# Altium project WAB_1x4.PrjPcb (part 2 of 2)

## Sheet WAB_1x4_top.SchDoc
size A2
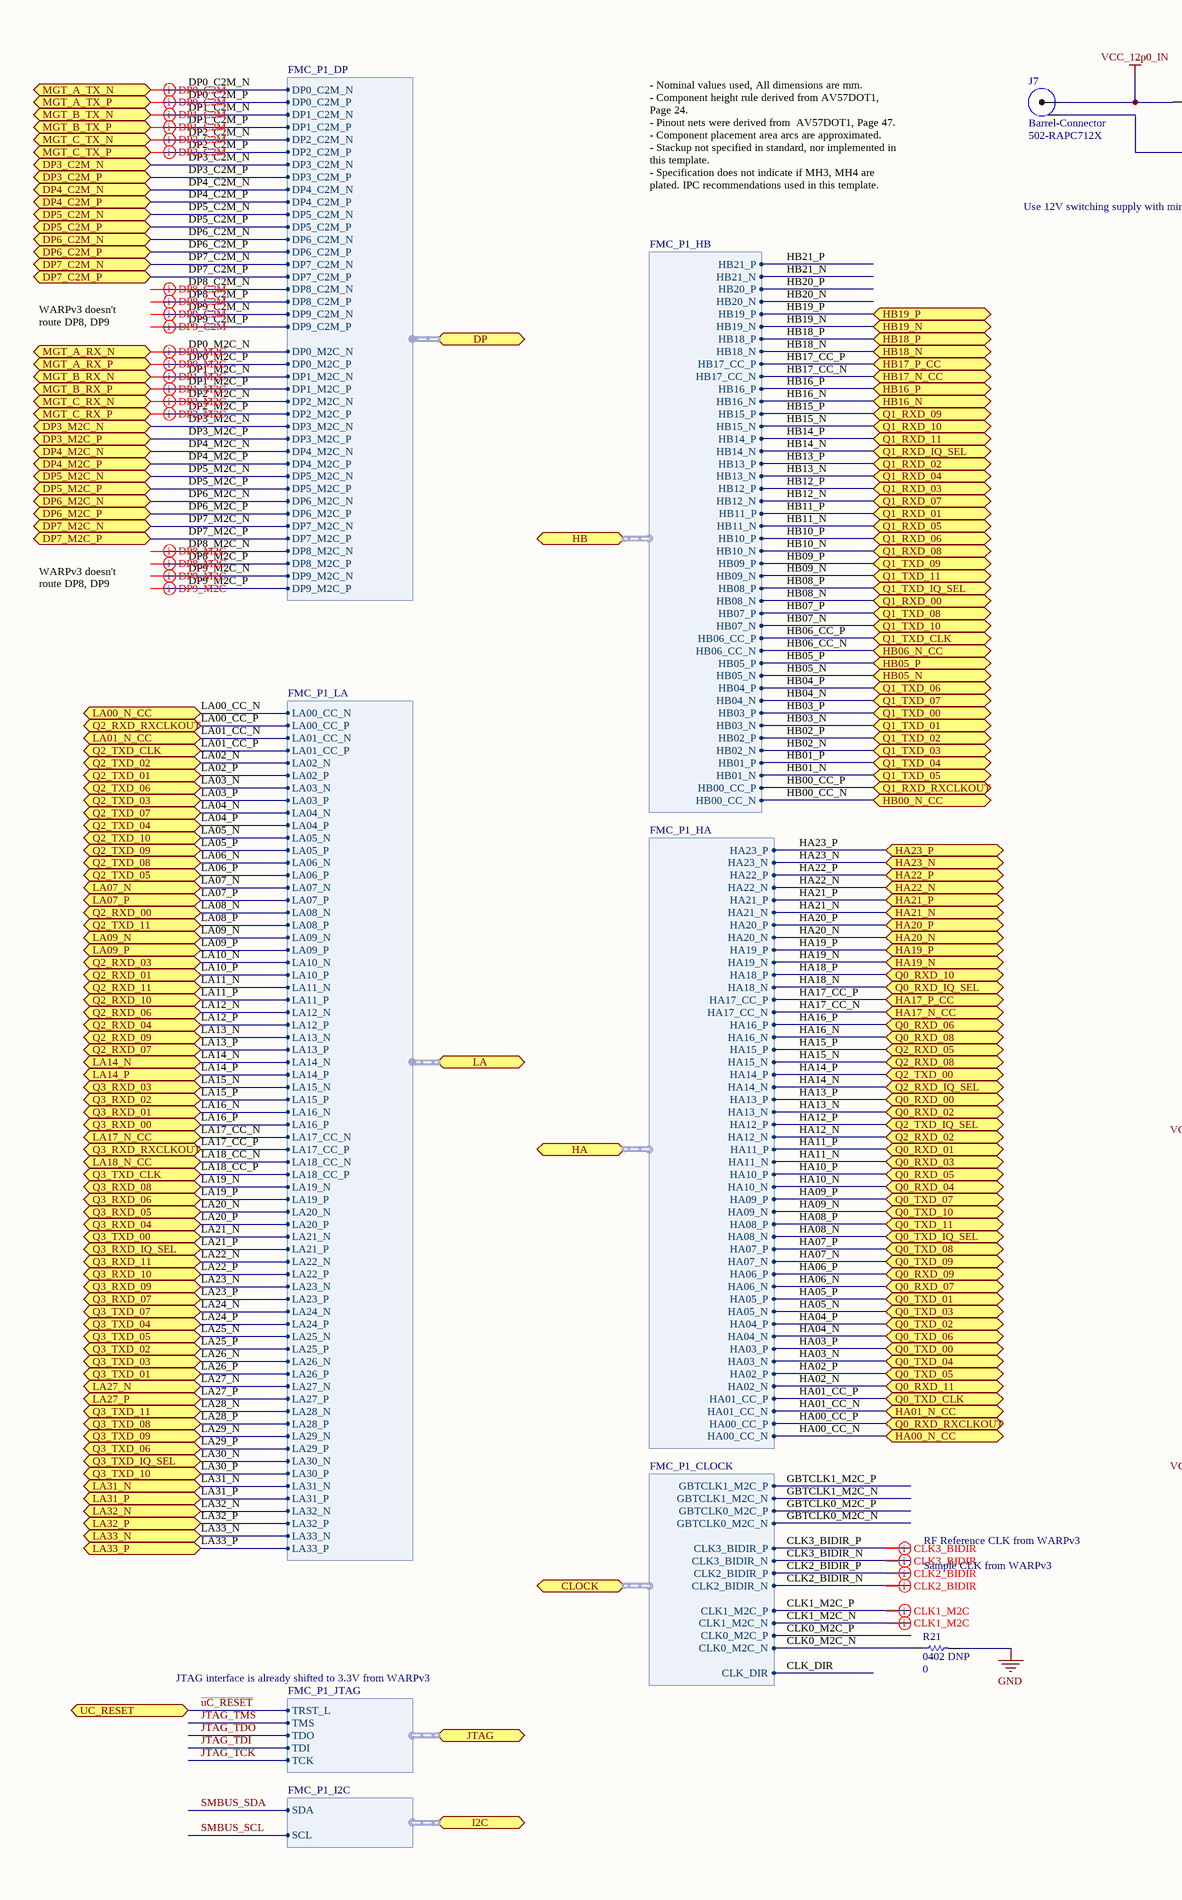
[diagram p4: WAB_1x4_top.SchDoc, left]
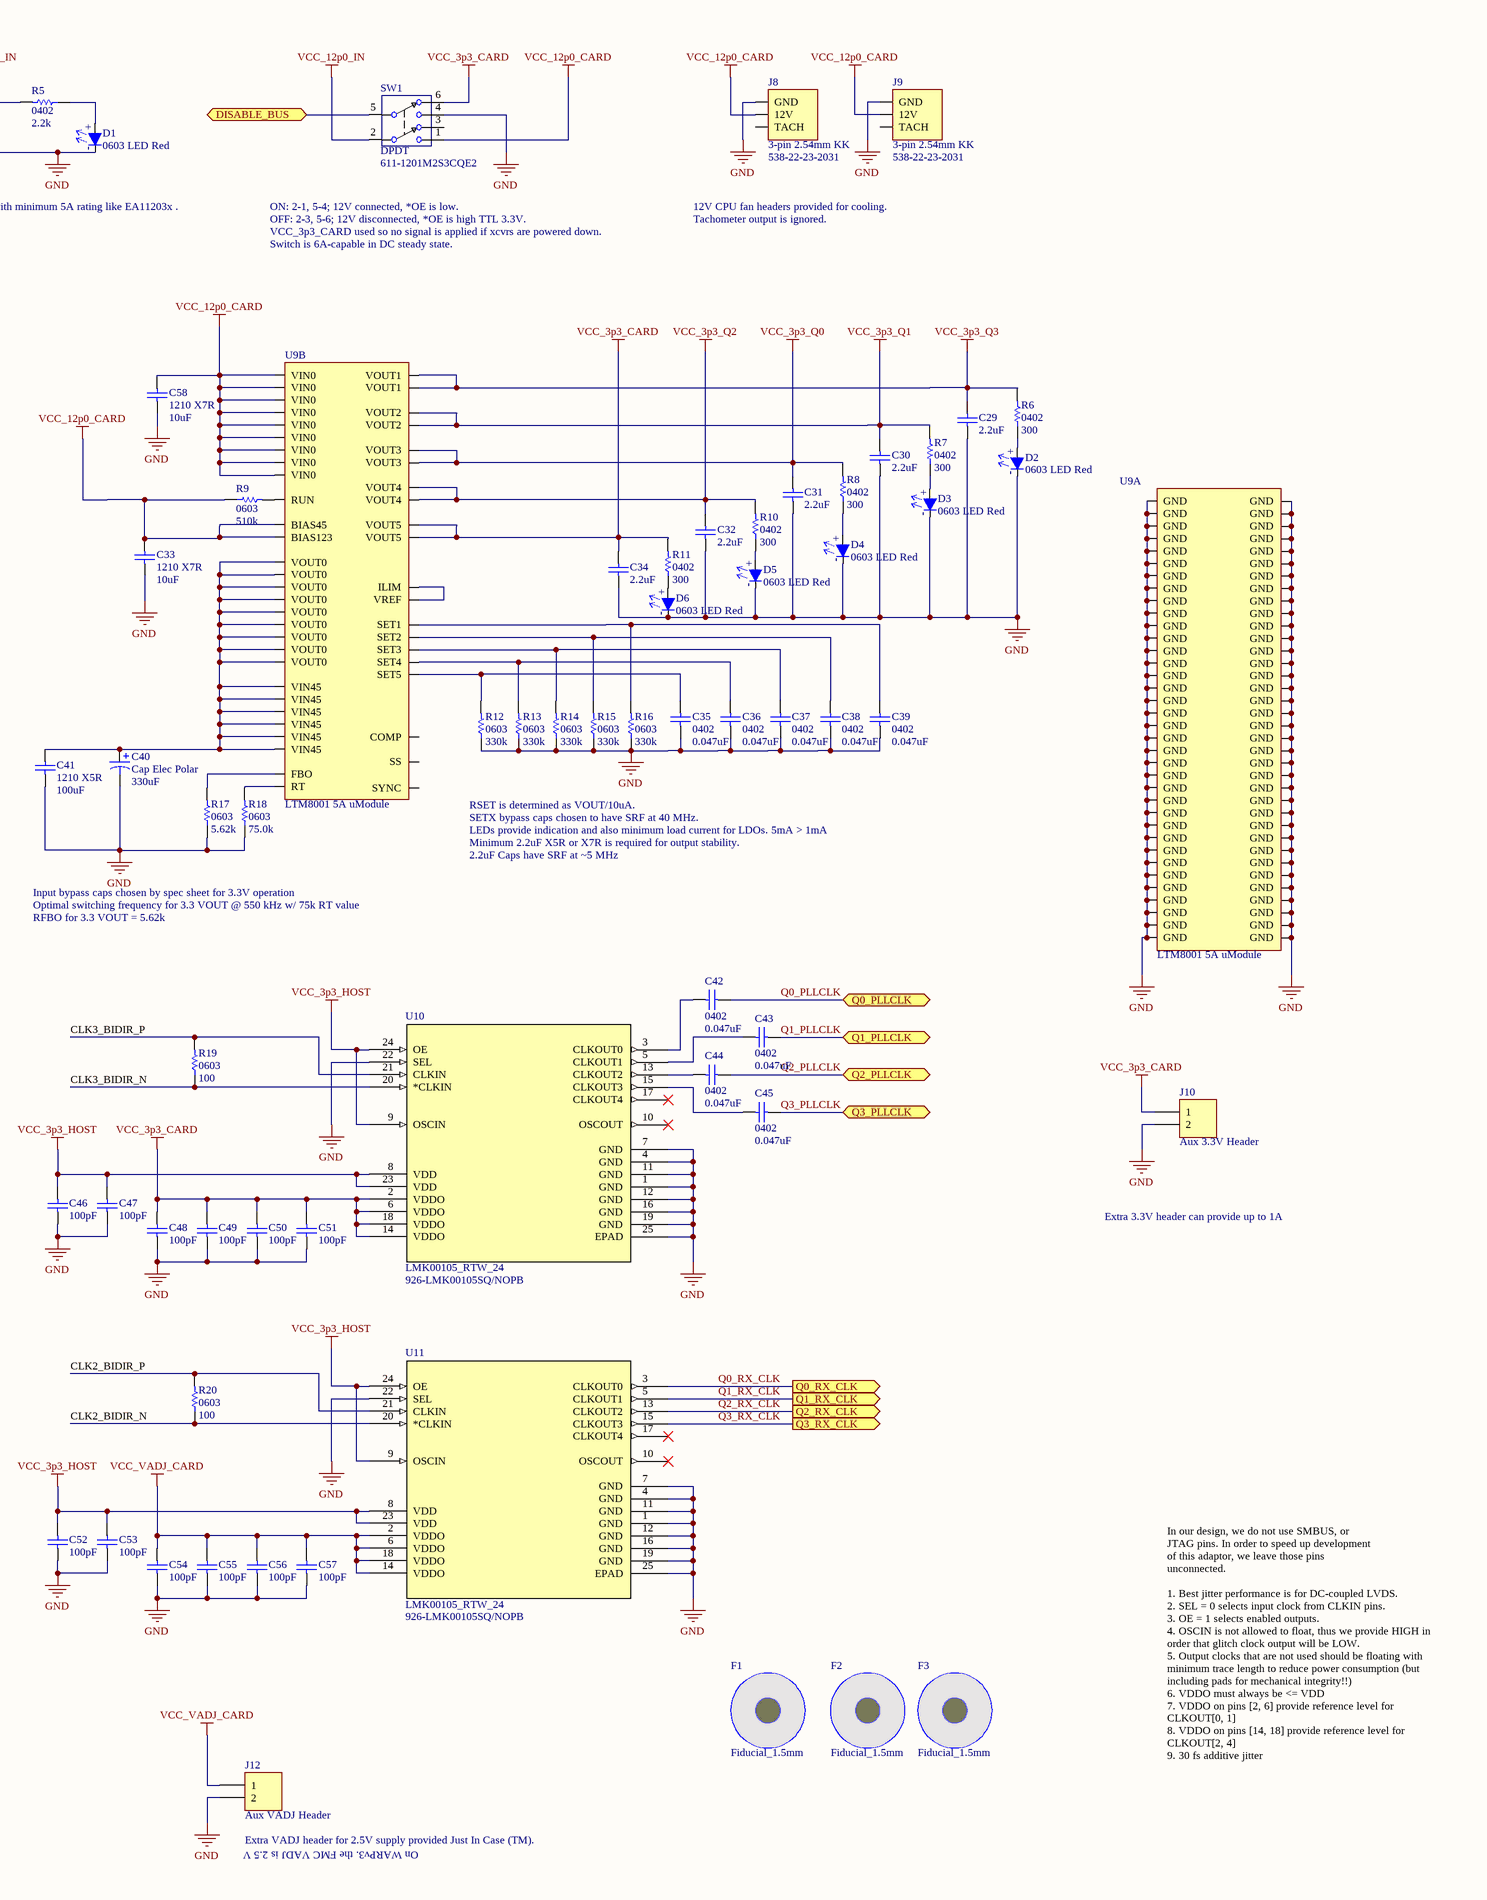
[diagram p5: WAB_1x4_top.SchDoc, right]

### Parts
C29  value 2.2uF  [0402_SMT_CAP]  (hidden comment: 0402)
C30  value 2.2uF  [0402_SMT_CAP]  (hidden comment: 0402)
C31  value 2.2uF  [0402_SMT_CAP]  (hidden comment: 0402)
C32  value 2.2uF  [0402_SMT_CAP]  (hidden comment: 0402)
C33  1210 X7R  value 10uF  [1210_Chip_Cap]
C34  value 2.2uF  [0402_SMT_CAP]  (hidden comment: 0402)
C35  0402  value 0.047uF  [0402_SMT_CAP]
C36  0402  value 0.047uF  [0402_SMT_CAP]
C37  0402  value 0.047uF  [0402_SMT_CAP]
C38  0402  value 0.047uF  [0402_SMT_CAP]
C39  0402  value 0.047uF  [0402_SMT_CAP]
C40  Cap Elec Polar  value 330uF  [OSCON-SVPC-C6-V3_V2]
C41  1210 X5R  value 100uF  [1210_Chip_Cap]
C42  0402  value 0.047uF  [0402_SMT_CAP]
C43  0402  value 0.047uF  [0402_SMT_CAP]
C44  0402  value 0.047uF  [0402_SMT_CAP]
C45  0402  value 0.047uF  [0402_SMT_CAP]
C46  value 100pF  [0603_SMT_CAP]  (hidden comment: 0603)
C47  value 100pF  [0603_SMT_CAP]  (hidden comment: 0603)
C48  value 100pF  [0603_SMT_CAP]  (hidden comment: 0603)
C49  value 100pF  [0603_SMT_CAP]  (hidden comment: 0603)
C50  value 100pF  [0603_SMT_CAP]  (hidden comment: 0603)
C51  value 100pF  [0603_SMT_CAP]  (hidden comment: 0603)
C52  value 100pF  [0603_SMT_CAP]  (hidden comment: 0603)
C53  value 100pF  [0603_SMT_CAP]  (hidden comment: 0603)
C54  value 100pF  [0603_SMT_CAP]  (hidden comment: 0603)
C55  value 100pF  [0603_SMT_CAP]  (hidden comment: 0603)
C56  value 100pF  [0603_SMT_CAP]  (hidden comment: 0603)
C57  value 100pF  [0603_SMT_CAP]  (hidden comment: 0603)
C58  1210 X7R  value 10uF  [1210_Chip_Cap]
D1  0603 LED Red  [0603_SMT_LED]
D2  0603 LED Red  [0603_SMT_LED]
D3  0603 LED Red  [0603_SMT_LED]
D4  0603 LED Red  [0603_SMT_LED]
D5  0603 LED Red  [0603_SMT_LED]
D6  0603 LED Red  [0603_SMT_LED]
F1  Fiducial_1.5mm  [1.5mm_FIDUCIAL_v4]
F2  Fiducial_1.5mm  [1.5mm_FIDUCIAL_v4]
F3  Fiducial_1.5mm  [1.5mm_FIDUCIAL_v4]
J7  Barrel-Connector  Supplier Part Number 1: 502-RAPC712X  [RAPC712X]
J8  3-pin 2.54mm KK  Supplier Part Number 1: 538-22-23-2031  [3-Pin_Fan_Header]
J9  3-pin 2.54mm KK  Supplier Part Number 1: 538-22-23-2031  [3-Pin_Fan_Header]
J10  Aux 3.3V Header  [HDR1X2]
J12  Aux VADJ Header  [HDR1X2]
R5  0402  value 2.2k  [0402_SMT_RES]
R6  0402  value 300  [0402_SMT_RES]
R7  0402  value 300  [0402_SMT_RES]
R8  0402  value 300  [0402_SMT_RES]
R9  0603  value 510k  [0603_SMT_RES]
R10  0402  value 300  [0402_SMT_RES]
R11  0402  value 300  [0402_SMT_RES]
R12  0603  value 330k  [0603_SMT_RES]
R13  0603  value 330k  [0603_SMT_RES]
R14  0603  value 330k  [0603_SMT_RES]
R15  0603  value 330k  [0603_SMT_RES]
R16  0603  value 330k  [0603_SMT_RES]
R17  0603  value 5.62k  [0603_SMT_RES]
R18  0603  value 75.0k  [0603_SMT_RES]
R19  0603  value 100  [0603_SMT_RES]
R20  0603  value 100  [0603_SMT_RES]
R21  0402 DNP  value 0  [0402_SMT_RES]
SW1  DPDT  Supplier Part Number 1: 611-1201M2S3CQE2  [1201-M2-S3-C-QE2]
U9  LTM8001 5A uModule  [BGA121_15x15x3.42]  (parts A,B of 2)
U10  LMK00105_RTW_24  Supplier Part Number 1: 926-LMK00105SQ/NOPB  [RTW24_3]
U11  LMK00105_RTW_24  Supplier Part Number 1: 926-LMK00105SQ/NOPB  [RTW24_3]

### Ports
CLOCK (harness FMC_P1_CLOCK), DISABLE_BUS (bidir), DP3_C2M_N (bidir), DP3_C2M_P (bidir), DP3_M2C_N (bidir), DP3_M2C_P (bidir), DP4_C2M_N (bidir), DP4_C2M_P (bidir), DP4_M2C_N (bidir), DP4_M2C_P (bidir), DP5_C2M_N (bidir), DP5_C2M_P (bidir), DP5_M2C_N (bidir), DP5_M2C_P (bidir), DP6_C2M_N (bidir), DP6_C2M_P (bidir), DP6_M2C_N (bidir), DP6_M2C_P (bidir), DP7_C2M_N (bidir), DP7_C2M_P (bidir), DP7_M2C_N (bidir), DP7_M2C_P (bidir), DP (harness FMC_P1_DP), HA00_N_CC (bidir), HA01_N_CC (bidir), HA17_N_CC (bidir), HA17_P_CC (bidir), HA19_N (bidir), HA19_P (bidir), HA20_N (bidir), HA20_P (bidir), HA21_N (bidir), HA21_P (bidir), HA22_N (bidir), HA22_P (bidir), HA23_N (bidir), HA23_P (bidir), HA (harness FMC_P1_HA), HB00_N_CC (bidir), HB05_N (bidir), HB05_P (bidir), HB06_N_CC (bidir), HB16_N (bidir), HB16_P (bidir), HB17_N_CC (bidir), HB17_P_CC (bidir), HB18_N (bidir), HB18_P (bidir), HB19_N (bidir), HB19_P (bidir), HB (harness FMC_P1_HB), I2C (harness FMC_P1_I2C), JTAG (harness FMC_P1_JTAG), LA00_N_CC (bidir), LA01_N_CC (bidir), LA07_N (bidir), LA07_P (bidir), LA09_N (bidir), LA09_P (bidir), LA14_N (bidir), LA14_P (bidir), LA17_N_CC (bidir), LA18_N_CC (bidir), LA27_N (bidir), LA27_P (bidir), LA31_N (bidir), LA31_P (bidir), LA32_N (bidir), LA32_P (bidir), LA33_N (bidir), LA33_P (bidir), LA (harness FMC_P1_LA), MGT_A_RX_N (bidir), MGT_A_RX_P (bidir), MGT_A_TX_N (bidir), MGT_A_TX_P (bidir), MGT_B_RX_N (bidir), MGT_B_RX_P (bidir), MGT_B_TX_N (bidir), MGT_B_TX_P (bidir), MGT_C_RX_N (bidir), MGT_C_RX_P (bidir), MGT_C_TX_N (bidir), MGT_C_TX_P (bidir), Q0_PLLCLK (bidir), Q0_RX_CLK (out), Q0_RXD_00 (bidir), Q0_RXD_01 (bidir), Q0_RXD_02 (bidir), Q0_RXD_03 (bidir), Q0_RXD_04 (bidir), Q0_RXD_05 (bidir), Q0_RXD_06 (bidir), Q0_RXD_07 (bidir), Q0_RXD_08 (bidir), Q0_RXD_09 (bidir), Q0_RXD_10 (bidir), Q0_RXD_11 (bidir), Q0_RXD_IQ_SEL (bidir), Q0_RXD_RXCLKOUT (bidir), Q0_TXD_00 (bidir), Q0_TXD_01 (bidir), Q0_TXD_02 (bidir), Q0_TXD_03 (bidir), Q0_TXD_04 (bidir), Q0_TXD_05 (bidir), Q0_TXD_06 (bidir), Q0_TXD_07 (bidir), Q0_TXD_08 (bidir), Q0_TXD_09 (bidir), Q0_TXD_10 (bidir), Q0_TXD_11 (bidir), Q0_TXD_CLK (bidir), Q0_TXD_IQ_SEL (bidir), Q1_PLLCLK (bidir), Q1_RX_CLK (out), Q1_RXD_00 (bidir), Q1_RXD_01 (bidir), Q1_RXD_02 (bidir), Q1_RXD_03 (bidir), Q1_RXD_04 (bidir), Q1_RXD_05 (bidir), Q1_RXD_06 (bidir), Q1_RXD_07 (bidir), Q1_RXD_08 (bidir), Q1_RXD_09 (bidir), Q1_RXD_10 (bidir), Q1_RXD_11 (bidir), Q1_RXD_IQ_SEL (bidir), Q1_RXD_RXCLKOUT (bidir), Q1_TXD_00 (bidir), Q1_TXD_01 (bidir), Q1_TXD_02 (bidir), Q1_TXD_03 (bidir), Q1_TXD_04 (bidir), Q1_TXD_05 (bidir), Q1_TXD_06 (bidir), Q1_TXD_07 (bidir), Q1_TXD_08 (bidir), Q1_TXD_09 (bidir), Q1_TXD_10 (bidir), Q1_TXD_11 (bidir), Q1_TXD_CLK (bidir), Q1_TXD_IQ_SEL (bidir), Q2_PLLCLK (bidir), Q2_RX_CLK (out), Q2_RXD_00 (bidir), Q2_RXD_01 (bidir), Q2_RXD_02 (bidir), Q2_RXD_03 (bidir), Q2_RXD_04 (bidir), Q2_RXD_05 (bidir), Q2_RXD_06 (bidir), Q2_RXD_07 (bidir), Q2_RXD_08 (bidir), Q2_RXD_09 (bidir), Q2_RXD_10 (bidir), Q2_RXD_11 (bidir), Q2_RXD_IQ_SEL (bidir), Q2_RXD_RXCLKOUT (bidir), Q2_TXD_00 (bidir), Q2_TXD_01 (bidir), Q2_TXD_02 (bidir), Q2_TXD_03 (bidir), Q2_TXD_04 (bidir), Q2_TXD_05 (bidir), Q2_TXD_06 (bidir), Q2_TXD_07 (bidir), Q2_TXD_08 (bidir), Q2_TXD_09 (bidir), Q2_TXD_10 (bidir), Q2_TXD_11 (bidir), Q2_TXD_CLK (bidir), Q2_TXD_IQ_SEL (bidir), Q3_PLLCLK (bidir), Q3_RX_CLK (out), Q3_RXD_00 (bidir), Q3_RXD_01 (bidir), Q3_RXD_02 (bidir), Q3_RXD_03 (bidir), Q3_RXD_04 (bidir), Q3_RXD_05 (bidir), Q3_RXD_06 (bidir), Q3_RXD_07 (bidir), Q3_RXD_08 (bidir), Q3_RXD_09 (bidir), Q3_RXD_10 (bidir), Q3_RXD_11 (bidir), Q3_RXD_IQ_SEL (bidir), Q3_RXD_RXCLKOUT (bidir), Q3_TXD_00 (bidir), Q3_TXD_01 (bidir), Q3_TXD_02 (bidir), Q3_TXD_03 (bidir), Q3_TXD_04 (bidir), Q3_TXD_05 (bidir), Q3_TXD_06 (bidir), Q3_TXD_07 (bidir), Q3_TXD_08 (bidir), Q3_TXD_09 (bidir), Q3_TXD_10 (bidir), Q3_TXD_11 (bidir), Q3_TXD_CLK (bidir), Q3_TXD_IQ_SEL (bidir), UC_RESET (bidir)

### Harnesses
FMC_P1_JTAG: TCK, TDI, TDO, TMS, TRST_L
FMC_P1_I2C: SCL, SDA
FMC_P1_LA: LA05_N, LA05_P, LA06_N, LA06_P, LA09_N, LA09_P, LA10_N, LA10_P, LA13_N, LA13_P, LA14_N, LA14_P, LA23_N, LA23_P, LA26_N, LA26_P, LA27_N, LA27_P, LA02_N, LA02_P, LA03_N, LA03_P, LA04_N, LA04_P, LA07_N, LA07_P, LA08_N, LA08_P, LA11_N, LA11_P, LA12_N, LA12_P, LA15_N, LA15_P, LA16_N, LA16_P, LA19_N, LA19_P, LA20_N, LA20_P, LA21_N, LA21_P, LA22_N, LA22_P, LA24_N, LA24_P, LA25_N, LA25_P, LA28_N, LA28_P, LA29_N, LA29_P, LA30_N, LA30_P, LA31_N, LA31_P, LA32_N, LA32_P, LA33_N, LA33_P, LA00_CC_N, LA00_CC_P, LA01_CC_N, LA01_CC_P, LA17_CC_N, LA17_CC_P, LA18_CC_N, LA18_CC_P
FMC_P1_CLOCK: CLK2_BIDIR_N, CLK2_BIDIR_P, CLK3_BIDIR_N, CLK3_BIDIR_P, CLK0_M2C_N, CLK0_M2C_P, CLK1_M2C_N, CLK1_M2C_P, CLK_DIR, GBTCLK0_M2C_N, GBTCLK0_M2C_P, GBTCLK1_M2C_N, GBTCLK1_M2C_P
FMC_P1_HA: HA00_CC_N, HA00_CC_P, HA01_CC_N, HA01_CC_P, HA02_N, HA02_P, HA03_N, HA03_P, HA04_N, HA04_P, HA05_N, HA05_P, HA06_N, HA06_P, HA07_N, HA07_P, HA08_N, HA08_P, HA09_N, HA09_P, HA10_N, HA10_P, HA11_N, HA11_P, HA12_N, HA12_P, HA13_N, HA13_P, HA14_N, HA14_P, HA15_N, HA15_P, HA16_N, HA16_P, HA17_CC_N, HA17_CC_P, HA18_N, HA18_P, HA19_N, HA19_P, HA20_N, HA20_P, HA21_N, HA21_P, HA22_N, HA22_P, HA23_N, HA23_P
FMC_P1_DP: DP1_C2M_N, DP1_C2M_P, DP1_M2C_N, DP1_M2C_P, DP2_C2M_N, DP2_C2M_P, DP2_M2C_N, DP2_M2C_P, DP3_C2M_N, DP3_C2M_P, DP3_M2C_N, DP3_M2C_P, DP4_C2M_N, DP4_C2M_P, DP4_M2C_N, DP4_M2C_P, DP5_C2M_N, DP5_C2M_P, DP5_M2C_N, DP5_M2C_P, DP6_C2M_N, DP6_C2M_P, DP6_M2C_N, DP6_M2C_P, DP7_C2M_N, DP7_C2M_P, DP7_M2C_N, DP7_M2C_P, DP8_C2M_N, DP8_C2M_P, DP8_M2C_N, DP8_M2C_P, DP9_C2M_N, DP9_C2M_P, DP9_M2C_N, DP9_M2C_P, DP0_C2M_N, DP0_C2M_P, DP0_M2C_N, DP0_M2C_P
FMC_P1_HB: HB02_N, HB02_P, HB03_N, HB03_P, HB04_N, HB04_P, HB05_N, HB05_P, HB08_N, HB08_P, HB09_N, HB09_P, HB12_N, HB12_P, HB13_N, HB13_P, HB16_N, HB16_P, HB19_N, HB19_P, HB20_N, HB20_P, HB21_N, HB21_P, HB01_N, HB01_P, HB07_N, HB07_P, HB10_N, HB10_P, HB11_N, HB11_P, HB14_N, HB14_P, HB15_N, HB15_P, HB18_N, HB18_P, HB17_CC_N, HB17_CC_P, HB06_CC_N, HB06_CC_P, HB00_CC_N, HB00_CC_P

### Nets
GND: C29.1 C30.1 C31.1 C32.1 C33.2 C34.1 C35.2 C36.2 C37.2 C38.2 C39.2 C40.2 C41.2 C46.1 C47.1 C48.1 C49.1 C50.1 C51.1 C52.1 C53.1 C54.1 C55.1 C56.1 C57.1 C58.2 D1.2(N) D2.2(N) D3.2(N) D4.2(N) D5.2(N) D6.2(N) J7.1(GND) J8.1(GND) J9.1(GND) J10.2 J12.2 R12.1 R13.1 R14.1 R15.1 R16.1 R17.1 R18.1 R21.2 SW1.4 U9.A1(GND) U9.A2(GND) U9.B1(GND) U9.B2(GND) U9.B9(GND) U9.B10(GND) U9.C1(GND) U9.C2(GND) U9.C8(GND) U9.C9(GND) U9.C10(GND) U9.D1(GND) U9.D2(GND) U9.D3(GND) U9.D4(GND) U9.D5(GND) U9.D6(GND) U9.D7(GND) U9.D8(GND) U9.D9(GND) U9.D10(GND) U9.E1(GND) U9.E2(GND) U9.E3(GND) U9.E4(GND) U9.E5(GND) U9.E6(GND) U9.E7(GND) U9.E8(GND) U9.E9(GND) U9.E10(GND) U9.F1(GND) U9.F2(GND) U9.F3(GND) U9.F4(GND) U9.F5(GND) U9.F6(GND) U9.F7(GND) U9.F8(GND) U9.F9(GND) U9.F10(GND) U9.G1(GND) U9.G2(GND) U9.G3(GND) U9.G4(GND) U9.G5(GND) U9.G6(GND) U9.G7(GND) U9.G8(GND) U9.G9(GND) U9.G10(GND) U9.H1(GND) U9.H2(GND) U9.H3(GND) U9.H4(GND) U9.H5(GND) U9.H6(GND) U9.H7(GND) U9.H8(GND) U9.H9(GND) U9.H10(GND) U9.J4(GND) U9.J5(GND) U9.J6(GND) U9.J7(GND) U9.J8(GND) U9.J9(GND) U9.J10(GND) U9.K5(GND) U9.K6(GND) U9.K9(GND) U9.K10(GND) U10.1(GND) U10.4(GND) U10.7(GND) U10.11(GND) U10.12(GND) U10.16(GND) U10.19(GND) U10.22(SEL) U10.25(EPAD) U11.1(GND) U11.4(GND) U11.7(GND) U11.11(GND) U11.12(GND) U11.16(GND) U11.19(GND) U11.22(SEL) U11.25(EPAD)
VCC_3p3_CARD: C34.2 C48.2 C49.2 C50.2 C51.2 J10.1 R11.2 SW1.6 U9.A10(VOUT5) U9.A11(VOUT5) U10.2(VDDO) U10.6(VDDO) U10.14(VDDO) U10.18(VDDO)
VCC_3p3_HOST: C46.2 C47.2 C52.2 C53.2 U10.8(VDD) U10.9(OSCIN) U10.23(VDD) U10.24(OE) U11.8(VDD) U11.9(OSCIN) U11.23(VDD) U11.24(OE)  [project net 3P3V]
VCC_3p3_Q0: C31.2 R8.2 U9.E11(VOUT3) U9.F11(VOUT3)
VCC_3p3_Q1: C30.2 R7.2 U9.J11(VOUT2) U9.K11(VOUT2)
VCC_3p3_Q2: C32.2 R10.2 U9.B11(VOUT4) U9.C11(VOUT4)
VCC_3p3_Q3: C29.2 R6.2 U9.L10(VOUT1) U9.L11(VOUT1)
VCC_12p0_CARD: C33.1 C58.1 J8.2(12V) J9.2(12V) R9.1 SW1.1 U9.A8(BIAS45) U9.B8(BIAS123) U9.J1(VIN0) U9.J2(VIN0) U9.J3(VIN0) U9.K1(VIN0) U9.K2(VIN0) U9.K3(VIN0) U9.L1(VIN0) U9.L2(VIN0) U9.L3(VIN0)
VCC_12p0_IN: J7.2(PWR) R5.2 SW1.2
VCC_VADJ_CARD: C54.2 C55.2 C56.2 C57.2 J12.1 U11.2(VDDO) U11.6(VDDO) U11.14(VDDO) U11.18(VDDO)  [project net VADJ]
~{uC_RESET}: port UC_RESET, port JTAG.TRST_L
CLK0_M2C_N: R21.1 ; port CLOCK.CLK0_M2C_N
CLK2_BIDIR_N: R20.1 U11.20(*CLKIN) ; port CLOCK.CLK2_BIDIR_N
CLK2_BIDIR_P: R20.2 U11.21(CLKIN) ; port CLOCK.CLK2_BIDIR_P
CLK3_BIDIR_N: R19.1 U10.20(*CLKIN) ; port CLOCK.CLK3_BIDIR_N
CLK3_BIDIR_P: R19.2 U10.21(CLKIN) ; port CLOCK.CLK3_BIDIR_P
DP0_C2M_N: port MGT_A_TX_N, port DP.DP0_C2M_N
DP0_C2M_P: port MGT_A_TX_P, port DP.DP0_C2M_P
DP0_M2C_N: port MGT_A_RX_N, port DP.DP0_M2C_N
DP0_M2C_P: port MGT_A_RX_P, port DP.DP0_M2C_P
DP1_C2M_N: port MGT_B_TX_N, port DP.DP1_C2M_N
DP1_C2M_P: port MGT_B_TX_P, port DP.DP1_C2M_P
DP1_M2C_N: port MGT_B_RX_N, port DP.DP1_M2C_N
DP1_M2C_P: port MGT_B_RX_P, port DP.DP1_M2C_P
DP2_C2M_N: port MGT_C_TX_N, port DP.DP2_C2M_N
DP2_C2M_P: port MGT_C_TX_P, port DP.DP2_C2M_P
DP2_M2C_N: port MGT_C_RX_N, port DP.DP2_M2C_N
DP2_M2C_P: port MGT_C_RX_P, port DP.DP2_M2C_P
DP3_C2M_N: port DP3_C2M_N, port DP.DP3_C2M_N
DP3_C2M_P: port DP3_C2M_P, port DP.DP3_C2M_P
DP3_M2C_N: port DP3_M2C_N, port DP.DP3_M2C_N
DP3_M2C_P: port DP3_M2C_P, port DP.DP3_M2C_P
DP4_C2M_N: port DP4_C2M_N, port DP.DP4_C2M_N
DP4_C2M_P: port DP4_C2M_P, port DP.DP4_C2M_P
DP4_M2C_N: port DP4_M2C_N, port DP.DP4_M2C_N
DP4_M2C_P: port DP4_M2C_P, port DP.DP4_M2C_P
DP5_C2M_N: port DP5_C2M_N, port DP.DP5_C2M_N
DP5_C2M_P: port DP5_C2M_P, port DP.DP5_C2M_P
DP5_M2C_N: port DP5_M2C_N, port DP.DP5_M2C_N
DP5_M2C_P: port DP5_M2C_P, port DP.DP5_M2C_P
DP6_C2M_N: port DP6_C2M_N, port DP.DP6_C2M_N
DP6_C2M_P: port DP6_C2M_P, port DP.DP6_C2M_P
DP6_M2C_N: port DP6_M2C_N, port DP.DP6_M2C_N
DP6_M2C_P: port DP6_M2C_P, port DP.DP6_M2C_P
DP7_C2M_N: port DP7_C2M_N, port DP.DP7_C2M_N
DP7_C2M_P: port DP7_C2M_P, port DP.DP7_C2M_P
DP7_M2C_N: port DP7_M2C_N, port DP.DP7_M2C_N
DP7_M2C_P: port DP7_M2C_P, port DP.DP7_M2C_P
GBTCLK1_M2C_N: port CLOCK.GBTCLK1_M2C_N
GBTCLK1_M2C_P: port CLOCK.GBTCLK1_M2C_P
HA00_CC_N: port HA00_N_CC, port HA.HA00_CC_N
HA00_CC_P: port Q0_RXD_RXCLKOUT, port HA.HA00_CC_P
HA01_CC_N: port HA01_N_CC, port HA.HA01_CC_N
HA01_CC_P: port Q0_TXD_CLK, port HA.HA01_CC_P
HA02_N: port Q0_RXD_11, port HA.HA02_N
HA02_P: port Q0_TXD_05, port HA.HA02_P
HA03_N: port Q0_TXD_04, port HA.HA03_N
HA03_P: port Q0_TXD_00, port HA.HA03_P
HA04_N: port Q0_TXD_06, port HA.HA04_N
HA04_P: port Q0_TXD_02, port HA.HA04_P
HA05_N: port Q0_TXD_03, port HA.HA05_N
HA05_P: port Q0_TXD_01, port HA.HA05_P
HA06_N: port Q0_RXD_07, port HA.HA06_N
HA06_P: port Q0_RXD_09, port HA.HA06_P
HA07_N: port Q0_TXD_09, port HA.HA07_N
HA07_P: port Q0_TXD_08, port HA.HA07_P
HA08_N: port Q0_TXD_IQ_SEL, port HA.HA08_N
HA08_P: port Q0_TXD_11, port HA.HA08_P
HA09_N: port Q0_TXD_10, port HA.HA09_N
HA09_P: port Q0_TXD_07, port HA.HA09_P
HA10_N: port Q0_RXD_04, port HA.HA10_N
HA10_P: port Q0_RXD_05, port HA.HA10_P
HA11_N: port Q0_RXD_03, port HA.HA11_N
HA11_P: port Q0_RXD_01, port HA.HA11_P
HA12_N: port Q2_RXD_02, port HA.HA12_N
HA12_P: port Q2_TXD_IQ_SEL, port HA.HA12_P
HA13_N: port Q0_RXD_02, port HA.HA13_N
HA13_P: port Q0_RXD_00, port HA.HA13_P
HA14_N: port Q2_RXD_IQ_SEL, port HA.HA14_N
HA14_P: port Q2_TXD_00, port HA.HA14_P
HA15_N: port Q2_RXD_08, port HA.HA15_N
HA15_P: port Q2_RXD_05, port HA.HA15_P
HA16_N: port Q0_RXD_08, port HA.HA16_N
HA16_P: port Q0_RXD_06, port HA.HA16_P
HA17_CC_N: port HA17_N_CC, port HA.HA17_CC_N
HA17_CC_P: port HA17_P_CC, port HA.HA17_CC_P
HA18_N: port Q0_RXD_IQ_SEL, port HA.HA18_N
HA18_P: port Q0_RXD_10, port HA.HA18_P
HA19_N: port HA19_N, port HA.HA19_N
HA19_P: port HA19_P, port HA.HA19_P
HA20_N: port HA20_N, port HA.HA20_N
HA20_P: port HA20_P, port HA.HA20_P
HA21_N: port HA21_N, port HA.HA21_N
HA21_P: port HA21_P, port HA.HA21_P
HA22_N: port HA22_N, port HA.HA22_N
HA22_P: port HA22_P, port HA.HA22_P
HA23_N: port HA23_N, port HA.HA23_N
HA23_P: port HA23_P, port HA.HA23_P
HB00_CC_N: port HB00_N_CC, port HB.HB00_CC_N
HB00_CC_P: port Q1_RXD_RXCLKOUT, port HB.HB00_CC_P
HB01_N: port Q1_TXD_05, port HB.HB01_N
HB01_P: port Q1_TXD_04, port HB.HB01_P
HB02_N: port Q1_TXD_03, port HB.HB02_N
HB02_P: port Q1_TXD_02, port HB.HB02_P
HB03_N: port Q1_TXD_01, port HB.HB03_N
HB03_P: port Q1_TXD_00, port HB.HB03_P
HB04_N: port Q1_TXD_07, port HB.HB04_N
HB04_P: port Q1_TXD_06, port HB.HB04_P
HB05_N: port HB05_N, port HB.HB05_N
HB05_P: port HB05_P, port HB.HB05_P
HB06_CC_N: port HB06_N_CC, port HB.HB06_CC_N
HB06_CC_P: port Q1_TXD_CLK, port HB.HB06_CC_P
HB07_N: port Q1_TXD_10, port HB.HB07_N
HB07_P: port Q1_TXD_08, port HB.HB07_P
HB08_N: port Q1_RXD_00, port HB.HB08_N
HB08_P: port Q1_TXD_IQ_SEL, port HB.HB08_P
HB09_N: port Q1_TXD_11, port HB.HB09_N
HB09_P: port Q1_TXD_09, port HB.HB09_P
HB10_N: port Q1_RXD_08, port HB.HB10_N
HB10_P: port Q1_RXD_06, port HB.HB10_P
HB11_N: port Q1_RXD_05, port HB.HB11_N
HB11_P: port Q1_RXD_01, port HB.HB11_P
HB12_N: port Q1_RXD_07, port HB.HB12_N
HB12_P: port Q1_RXD_03, port HB.HB12_P
HB13_N: port Q1_RXD_04, port HB.HB13_N
HB13_P: port Q1_RXD_02, port HB.HB13_P
HB14_N: port Q1_RXD_IQ_SEL, port HB.HB14_N
HB14_P: port Q1_RXD_11, port HB.HB14_P
HB15_N: port Q1_RXD_10, port HB.HB15_N
HB15_P: port Q1_RXD_09, port HB.HB15_P
HB16_N: port HB16_N, port HB.HB16_N
HB16_P: port HB16_P, port HB.HB16_P
HB17_CC_N: port HB17_N_CC, port HB.HB17_CC_N
HB17_CC_P: port HB17_P_CC, port HB.HB17_CC_P
HB18_N: port HB18_N, port HB.HB18_N
HB18_P: port HB18_P, port HB.HB18_P
HB19_N: port HB19_N, port HB.HB19_N
HB19_P: port HB19_P, port HB.HB19_P
LA00_CC_N: port LA00_N_CC, port LA.LA00_CC_N
LA00_CC_P: port Q2_RXD_RXCLKOUT, port LA.LA00_CC_P
LA01_CC_N: port LA01_N_CC, port LA.LA01_CC_N
LA01_CC_P: port Q2_TXD_CLK, port LA.LA01_CC_P
LA02_N: port Q2_TXD_02, port LA.LA02_N
LA02_P: port Q2_TXD_01, port LA.LA02_P
LA03_N: port Q2_TXD_06, port LA.LA03_N
LA03_P: port Q2_TXD_03, port LA.LA03_P
LA04_N: port Q2_TXD_07, port LA.LA04_N
LA04_P: port Q2_TXD_04, port LA.LA04_P
LA05_N: port Q2_TXD_10, port LA.LA05_N
LA05_P: port Q2_TXD_09, port LA.LA05_P
LA06_N: port Q2_TXD_08, port LA.LA06_N
LA06_P: port Q2_TXD_05, port LA.LA06_P
LA07_N: port LA07_N, port LA.LA07_N
LA07_P: port LA07_P, port LA.LA07_P
LA08_N: port Q2_RXD_00, port LA.LA08_N
LA08_P: port Q2_TXD_11, port LA.LA08_P
LA09_N: port LA09_N, port LA.LA09_N
LA09_P: port LA09_P, port LA.LA09_P
LA10_N: port Q2_RXD_03, port LA.LA10_N
LA10_P: port Q2_RXD_01, port LA.LA10_P
LA11_N: port Q2_RXD_11, port LA.LA11_N
LA11_P: port Q2_RXD_10, port LA.LA11_P
LA12_N: port Q2_RXD_06, port LA.LA12_N
LA12_P: port Q2_RXD_04, port LA.LA12_P
LA13_N: port Q2_RXD_09, port LA.LA13_N
LA13_P: port Q2_RXD_07, port LA.LA13_P
LA14_N: port LA14_N, port LA.LA14_N
LA14_P: port LA14_P, port LA.LA14_P
LA15_N: port Q3_RXD_03, port LA.LA15_N
LA15_P: port Q3_RXD_02, port LA.LA15_P
LA16_N: port Q3_RXD_01, port LA.LA16_N
LA16_P: port Q3_RXD_00, port LA.LA16_P
LA17_CC_N: port LA17_N_CC, port LA.LA17_CC_N
LA17_CC_P: port Q3_RXD_RXCLKOUT, port LA.LA17_CC_P
LA18_CC_N: port LA18_N_CC, port LA.LA18_CC_N
LA18_CC_P: port Q3_TXD_CLK, port LA.LA18_CC_P
LA19_N: port Q3_RXD_08, port LA.LA19_N
LA19_P: port Q3_RXD_06, port LA.LA19_P
LA20_N: port Q3_RXD_05, port LA.LA20_N
LA20_P: port Q3_RXD_04, port LA.LA20_P
LA21_N: port Q3_TXD_00, port LA.LA21_N
LA21_P: port Q3_RXD_IQ_SEL, port LA.LA21_P
LA22_N: port Q3_RXD_11, port LA.LA22_N
LA22_P: port Q3_RXD_10, port LA.LA22_P
LA23_N: port Q3_RXD_09, port LA.LA23_N
LA23_P: port Q3_RXD_07, port LA.LA23_P
LA24_N: port Q3_TXD_07, port LA.LA24_N
LA24_P: port Q3_TXD_04, port LA.LA24_P
LA25_N: port Q3_TXD_05, port LA.LA25_N
LA25_P: port Q3_TXD_02, port LA.LA25_P
LA26_N: port Q3_TXD_03, port LA.LA26_N
LA26_P: port Q3_TXD_01, port LA.LA26_P
LA27_N: port LA27_N, port LA.LA27_N
LA27_P: port LA27_P, port LA.LA27_P
LA28_N: port Q3_TXD_11, port LA.LA28_N
LA28_P: port Q3_TXD_08, port LA.LA28_P
LA29_N: port Q3_TXD_09, port LA.LA29_N
LA29_P: port Q3_TXD_06, port LA.LA29_P
LA30_N: port Q3_TXD_IQ_SEL, port LA.LA30_N
LA30_P: port Q3_TXD_10, port LA.LA30_P
LA31_N: port LA31_N, port LA.LA31_N
LA31_P: port LA31_P, port LA.LA31_P
LA32_N: port LA32_N, port LA.LA32_N
LA32_P: port LA32_P, port LA.LA32_P
LA33_N: port LA33_N, port LA.LA33_N
LA33_P: port LA33_P, port LA.LA33_P
Q0_PLLCLK: C42.2 ; port Q0_PLLCLK
Q0_RX_CLK: U11.3(CLKOUT0) ; port Q0_RX_CLK
Q1_PLLCLK: C43.2 ; port Q1_PLLCLK
Q1_RX_CLK: U11.5(CLKOUT1) ; port Q1_RX_CLK
Q2_PLLCLK: C44.2 ; port Q2_PLLCLK
Q2_RX_CLK: U11.13(CLKOUT2) ; port Q2_RX_CLK
Q3_PLLCLK: C45.2 ; port Q3_PLLCLK
Q3_RX_CLK: U11.15(CLKOUT3) ; port Q3_RX_CLK
NetC35_1: C35.1 R12.2 U9.A9(SET5)
NetC36_1: C36.1 R13.2 U9.D11(SET4)
NetC37_1: C37.1 R14.2 U9.G11(SET3)
NetC38_1: C38.1 R15.2 U9.H11(SET2)
NetC39_1: C39.1 R16.2 U9.L9(SET1)
NetC40_1: C40.1 C41.1 U9.A3(VOUT0) U9.A4(VOUT0) U9.A5(VOUT0) U9.A6(VIN45) U9.A7(VIN45) U9.B3(VOUT0) U9.B4(VOUT0) U9.B5(VOUT0) U9.B6(VIN45) U9.B7(VIN45) U9.C3(VOUT0) U9.C4(VOUT0) U9.C5(VOUT0) U9.C6(VIN45) U9.C7(VIN45)
NetC42_1: C42.1 U10.3(CLKOUT0)
NetC43_1: C43.1 U10.5(CLKOUT1)
NetC44_1: C44.1 U10.13(CLKOUT2)
NetC45_1: C45.1 U10.15(CLKOUT3)
NetD1_1: D1.1(P) R5.1
NetD2_1: D2.1(P) R6.1
NetD3_1: D3.1(P) R7.1
NetD4_1: D4.1(P) R8.1
NetD5_1: D5.1(P) R10.1
NetD6_1: D6.1(P) R11.1
NetR9_2: R9.2 U9.L4(RUN)
NetR17_2: R17.2 U9.L5(FBO)
NetR18_2: R18.2 U9.L7(RT)
NetSW1_5: SW1.5 ; port DISABLE_BUS
NetU9_K8: U9.K8(VREF) U9.L8(ILIM)

Not connected (* = marked no-connect by the designer): J8 3(TACH); J9 3(TACH); SW1 3; U9 K4(SS) K7(SYNC) L6(COMP); U10 10(OSCOUT)* 17(CLKOUT4)*; U11 10(OSCOUT)* 17(CLKOUT4)*

### Layout directives
differential pair: CLK1_M2C_N, CLK1_M2C_P, CLK2_BIDIR_N, CLK2_BIDIR_P, CLK3_BIDIR_N, CLK3_BIDIR_P, DP0_C2M_N, DP0_C2M_P, DP0_M2C_N, DP0_M2C_P, DP1_C2M_N, DP1_C2M_P, DP1_M2C_N, DP1_M2C_P, DP2_C2M_N, DP2_C2M_P, DP2_M2C_N, DP2_M2C_P, DP8_C2M_N, DP8_C2M_P, DP8_M2C_N, DP8_M2C_P, DP9_C2M_N, DP9_C2M_P, DP9_M2C_N, DP9_M2C_P

### Notes on the sheet
- - Nominal values used, All dimensions are mm.
  - Component height rule derived from AV57DOT1, Page 24.
  - Pinout nets were derived from  AV57DOT1, Page 47.
  - Component placement area arcs are approximated.
  - Stackup not specified in standard, nor implemented in this template.
  - Specification does not indicate if MH3, MH4 are plated. IPC recommendations used in this template.
- Use 12V switching supply with minimum 5A rating like EA11203x .
- ON: 2-1, 5-4; 12V connected, *OE is low.
- 12V CPU fan headers provided for cooling.
- OFF: 2-3, 5-6; 12V disconnected, *OE is high TTL 3.3V.
- VCC_3p3_CARD used so no signal is applied if xcvrs are powered down.
- Switch is 6A-capable in DC steady state.
- Tachometer output is ignored.
- WARPv3 doesn't route DP8, DP9
- RSET is determined as VOUT/10uA.
- LEDs provide indication and also minimum load current for LDOs. 5mA > 1mA
- SETX bypass caps chosen to have SRF at 40 MHz.
- Input bypass caps chosen by spec sheet for 3.3V operation
- 2.2uF Caps have SRF at ~5 MHz
- Minimum 2.2uF X5R or X7R is required for output stability.
- Optimal switching frequency for 3.3 VOUT @ 550 kHz w/ 75k RT value
- RFBO for 3.3 VOUT = 5.62k
- Extra 3.3V header can provide up to 1A
- RF Reference CLK from WARPv3
- Sample CLK from WARPv3
- In our design, we do not use SMBUS, or JTAG pins. In order to speed up development of this adaptor, we leave those pins unconnected.
- JTAG interface is already shifted to 3.3V from WARPv3
- 1. Best jitter performance is for DC-coupled LVDS.
  2. SEL = 0 selects input clock from CLKIN pins.
  3. OE = 1 selects enabled outputs.
  4. OSCIN is not allowed to float, thus we provide HIGH in order that glitch clock output will be LOW.
  5. Output clocks that are not used should be floating with minimum trace length to reduce power consumption (but including pads for mechanical integrity!!)
  6. VDDO must always be <= VDD
  7. VDDO on pins [2, 6] provide reference level for
  CLKOUT[0, 1]
  8. VDDO on pins [14, 18] provide reference level for
  CLKOUT[2, 4]
  9. 30 fs additive jitter
- (near J12) Extra VADJ header for 2.5V supply provided Just In Case (TM).
- On WARPv3. the FMC VADJ is 2.5 V
- (in symbol LED_0603_Red) +; -

### Library data of the parts
C29-C32 C34-C39 C42-C45 = Cap_0402: 0402 SMT Capacitor; Supplier 1: Mouser
  C29-C32 C34: Supplier Part Number 1: 810-C1005X5R1A225K
  C35-C39 C42-C45: Supplier Part Number 1: 81-GRM155R71E473KA88
C33 C41 C58 = Cap_1210: 1210 SMT Capacitor; Supplier 1: Mouser
  C33 C58: Supplier Part Number 1: 963-UMK325AB7106KM-T
  C41: Supplier Part Number 1: 963-JMK325BJ107MY-T
C40 = Cap Pol3: Polarized Capacitor (SMT Electrolytic); Published: 8-Jun-2000; LatestRevisionDate: 29-May-2009; Publisher: Altium Limited; Supplier 1: Mouser; Supplier Part Number 1: 667-4SVPC330MV
C46-C57 = Cap_0603: 0603 SMT Capacitor; Supplier 1: Mouser; Supplier Part Number 1: 81-GRM39C101J50
D1-D6 = LED_0603_Red: 0603 LED with Polar Markings; Supplier 1: Mouser; Supplier Part Number 1: 859-LTSTC193KRKT5A
J7 = Barrel-Connector-RAPC712X: 2.5mm Barrel Jack Rt-Angle Thru-Mount; Supplier 1: Mouser
J8 J9 = 3-Pin 2.54mm Fan Header: Molex KK Series PCB Mount 3-pin 2.54mm Fan Header; Supplier 1: Mouser
J10 J12 = Header 2: Header, 2-Pin; LatestRevisionDate: 17-Jul-2002; LatestRevisionNote: Re-released for DXP Platform.; Publisher: Altium Limited
R5-R8 R10 R11 R21 = Res_0402: 0402 SMT Resistor; Supplier 1: Mouser
  R5: Supplier Part Number 1: 660-RK73B1ETTP222J
  R6-R8 R10 R11: Supplier Part Number 1: 660-RK73B1ETTP301J
  R21: Supplier Part Number 1: 594-MCS04020Z0000ZE0
R9 R12-R20 = Res_0603: 0603 SMT Resistor; Supplier 1: Mouser
  R9: Supplier Part Number 1: 660-RK73H1JTTD5103F
  R12-R16: Supplier Part Number 1: 667-ERA-3AEB334V
  R17: Supplier Part Number 1: 756-PCF0603R-5K62BT1
  R18: Supplier Part Number 1: 756-PCF0603R-4K75BT1
  R19 R20: Supplier Part Number 1: 660-RK73H1JTTD1000F
SW1 = 1201-M2-S2-C-X-XXX: DPDT 6A Slide Switch C&K Thru; Supplier 1: Mouser
U9 = LTM8001_BGA121: 36Vin, 5A uModule Regulator with 5-Output Configurable LDO Array; Supplier 1: Arrow; Supplier 2: Digi-Key; Supplier Part Number 1: 3pgs072oysQdu_9ve5ujledTf9bcEW9xL7FmiN346gk; Supplier Part Number 2: LTM8001EY#PBF-ND
U10 U11 = LMK00105_RTW_24: TI Universal-to-CMOS 5-Output Clock Buffer; Vendor: TEXAS INSTRUMENTS; Manufacturer_Part_Number: lmk00105_rtw_24; RefDes: RefDes; Type: DEV; Value: Value; Supplier 1: Mouser

## Nets that join several sheets
3P3V: FMC_HPC_400 (P1.C39 P1.D36 P1.D38 P1.D40), WAB_1x4_top (12 pins)
GND: FMC_HPC_400 (160 pins), WAB_1x4_bus_transceivers (58 pins), WAB_1x4_HSMC_slots (48 pins), WAB_1x4_top (136 pins)
VADJ: FMC_HPC_400 (P1.E39 P1.F40 P1.G39 P1.H40), WAB_1x4_bus_transceivers (23 pins), WAB_1x4_HSMC_slots (8 pins), WAB_1x4_top (9 pins)
VCC_3p3_CARD: WAB_1x4_bus_transceivers (24 pins), WAB_1x4_top (14 pins)
VCC_3p3_Q0: WAB_1x4_HSMC_slots (20 pins), WAB_1x4_top (C31.2 R8.2 U9.E11 U9.F11)
VCC_3p3_Q1: WAB_1x4_HSMC_slots (20 pins), WAB_1x4_top (C30.2 R7.2 U9.J11 U9.K11)
VCC_3p3_Q2: WAB_1x4_HSMC_slots (20 pins), WAB_1x4_top (C32.2 R10.2 U9.B11 U9.C11)
VCC_3p3_Q3: WAB_1x4_HSMC_slots (20 pins), WAB_1x4_top (C29.2 R6.2 U9.L10 U9.L11)
VCC_12p0_CARD: WAB_1x4_HSMC_slots (76 pins), WAB_1x4_top (17 pins)
~{uC_RESET}: FMC_HPC_400 (P1.D34), WAB_1x4_HSMC_slots (J0.122 J1.122 J2.122 J3.122)
CLK0_M2C_N: FMC_HPC_400 (P1.H5), WAB_1x4_top (R21.1)
CLK2_BIDIR_N: FMC_HPC_400 (P1.K5), WAB_1x4_top (R20.1 U11.20)
CLK2_BIDIR_P: FMC_HPC_400 (P1.K4), WAB_1x4_top (R20.2 U11.21)
CLK3_BIDIR_N: FMC_HPC_400 (P1.J3), WAB_1x4_top (R19.1 U10.20)
CLK3_BIDIR_P: FMC_HPC_400 (P1.J2), WAB_1x4_top (R19.2 U10.21)
DP0_C2M_N: FMC_HPC_400 (P1.C3), WAB_1x4_bus_transceivers (C18.2)
DP0_C2M_P: FMC_HPC_400 (P1.C2), WAB_1x4_bus_transceivers (C17.2)
DP0_M2C_N: FMC_HPC_400 (P1.C7), WAB_1x4_bus_transceivers (C19.2)
DP0_M2C_P: FMC_HPC_400 (P1.C6), WAB_1x4_bus_transceivers (C20.2)
DP1_C2M_N: FMC_HPC_400 (P1.A23), WAB_1x4_bus_transceivers (C22.2)
DP1_C2M_P: FMC_HPC_400 (P1.A22), WAB_1x4_bus_transceivers (C21.2)
DP1_M2C_N: FMC_HPC_400 (P1.A3), WAB_1x4_bus_transceivers (C23.2)
DP1_M2C_P: FMC_HPC_400 (P1.A2), WAB_1x4_bus_transceivers (C24.2)
DP2_C2M_N: FMC_HPC_400 (P1.A27), WAB_1x4_bus_transceivers (C26.2)
DP2_C2M_P: FMC_HPC_400 (P1.A26), WAB_1x4_bus_transceivers (C25.2)
DP2_M2C_N: FMC_HPC_400 (P1.A7), WAB_1x4_bus_transceivers (C27.2)
DP2_M2C_P: FMC_HPC_400 (P1.A6), WAB_1x4_bus_transceivers (C28.2)
DP3_C2M_N: FMC_HPC_400 (P1.A31), WAB_1x4_bus_transceivers (U2.8)
DP3_C2M_P: FMC_HPC_400 (P1.A30), WAB_1x4_bus_transceivers (U5.7)
DP3_M2C_N: FMC_HPC_400 (P1.A11), WAB_1x4_bus_transceivers (U2.7)
DP3_M2C_P: FMC_HPC_400 (P1.A10), WAB_1x4_bus_transceivers (U2.6)
DP4_C2M_N: FMC_HPC_400 (P1.A35), WAB_1x4_bus_transceivers (U7.5)
DP4_C2M_P: FMC_HPC_400 (P1.A34), WAB_1x4_bus_transceivers (U7.6)
DP4_M2C_N: FMC_HPC_400 (P1.A15), WAB_1x4_bus_transceivers (U7.3)
DP4_M2C_P: FMC_HPC_400 (P1.A14), WAB_1x4_bus_transceivers (U7.4)
DP5_C2M_N: FMC_HPC_400 (P1.A39), WAB_1x4_bus_transceivers (U5.5)
DP5_C2M_P: FMC_HPC_400 (P1.A38), WAB_1x4_bus_transceivers (U5.6)
DP5_M2C_N: FMC_HPC_400 (P1.A19), WAB_1x4_bus_transceivers (U5.3)
DP5_M2C_P: FMC_HPC_400 (P1.A18), WAB_1x4_bus_transceivers (U5.4)
DP6_C2M_N: FMC_HPC_400 (P1.B37), WAB_1x4_bus_transceivers (U6.5)
DP6_C2M_P: FMC_HPC_400 (P1.B36), WAB_1x4_bus_transceivers (U6.6)
DP6_M2C_N: FMC_HPC_400 (P1.B17), WAB_1x4_bus_transceivers (U6.3)
DP6_M2C_P: FMC_HPC_400 (P1.B16), WAB_1x4_bus_transceivers (U6.4)
DP7_C2M_N: FMC_HPC_400 (P1.B33), WAB_1x4_bus_transceivers (U8.5)
DP7_C2M_P: FMC_HPC_400 (P1.B32), WAB_1x4_bus_transceivers (U8.6)
DP7_M2C_N: FMC_HPC_400 (P1.B13), WAB_1x4_bus_transceivers (U8.3)
DP7_M2C_P: FMC_HPC_400 (P1.B12), WAB_1x4_bus_transceivers (U8.4)
HA00_CC_N: FMC_HPC_400 (P1.F5), WAB_1x4_bus_transceivers (U5.10)
HA00_CC_P: FMC_HPC_400 (P1.F4), WAB_1x4_HSMC_slots (J0.120)
HA01_CC_N: FMC_HPC_400 (P1.E3), WAB_1x4_bus_transceivers (U2.5)
HA01_CC_P: FMC_HPC_400 (P1.E2), WAB_1x4_HSMC_slots (J0.96)
HA02_N: FMC_HPC_400 (P1.K8), WAB_1x4_HSMC_slots (J0.73)
HA02_P: FMC_HPC_400 (P1.K7), WAB_1x4_HSMC_slots (J0.56)
HA03_N: FMC_HPC_400 (P1.J7), WAB_1x4_HSMC_slots (J0.54)
HA03_P: FMC_HPC_400 (P1.J6), WAB_1x4_HSMC_slots (J0.42)
HA04_N: FMC_HPC_400 (P1.F8), WAB_1x4_HSMC_slots (J0.60)
HA04_P: FMC_HPC_400 (P1.F7), WAB_1x4_HSMC_slots (J0.48)
HA05_N: FMC_HPC_400 (P1.E7), WAB_1x4_HSMC_slots (J0.50)
HA05_P: FMC_HPC_400 (P1.E6), WAB_1x4_HSMC_slots (J0.44)
HA06_N: FMC_HPC_400 (P1.K11), WAB_1x4_HSMC_slots (J0.61)
HA06_P: FMC_HPC_400 (P1.K10), WAB_1x4_HSMC_slots (J0.67)
HA07_N: FMC_HPC_400 (P1.J10), WAB_1x4_HSMC_slots (J0.68)
HA07_P: FMC_HPC_400 (P1.J9), WAB_1x4_HSMC_slots (J0.66)
HA08_N: FMC_HPC_400 (P1.F11), WAB_1x4_HSMC_slots (J0.80)
HA08_P: FMC_HPC_400 (P1.F10), WAB_1x4_HSMC_slots (J0.74)
HA09_N: FMC_HPC_400 (P1.E10), WAB_1x4_HSMC_slots (J0.72)
HA09_P: FMC_HPC_400 (P1.E9), WAB_1x4_HSMC_slots (J0.62)
HA10_N: FMC_HPC_400 (P1.K14), WAB_1x4_HSMC_slots (J0.53)
HA10_P: FMC_HPC_400 (P1.K13), WAB_1x4_HSMC_slots (J0.55)
HA11_N: FMC_HPC_400 (P1.J13), WAB_1x4_HSMC_slots (J0.49)
HA11_P: FMC_HPC_400 (P1.J12), WAB_1x4_HSMC_slots (J0.43)
HA12_N: FMC_HPC_400 (P1.F14), WAB_1x4_HSMC_slots (J2.47)
HA12_P: FMC_HPC_400 (P1.F13), WAB_1x4_HSMC_slots (J2.80)
HA13_N: FMC_HPC_400 (P1.E13), WAB_1x4_HSMC_slots (J0.47)
HA13_P: FMC_HPC_400 (P1.E12), WAB_1x4_HSMC_slots (J0.41)
HA14_N: FMC_HPC_400 (P1.J16), WAB_1x4_HSMC_slots (J2.79)
HA14_P: FMC_HPC_400 (P1.J15), WAB_1x4_HSMC_slots (J2.42)
HA15_N: FMC_HPC_400 (P1.F17), WAB_1x4_HSMC_slots (J2.65)
HA15_P: FMC_HPC_400 (P1.F16), WAB_1x4_HSMC_slots (J2.55)
HA16_N: FMC_HPC_400 (P1.E16), WAB_1x4_HSMC_slots (J0.65)
HA16_P: FMC_HPC_400 (P1.E15), WAB_1x4_HSMC_slots (J0.59)
HA17_CC_N: FMC_HPC_400 (P1.K17), WAB_1x4_bus_transceivers (U2.4)
HA17_CC_P: FMC_HPC_400 (P1.K16), WAB_1x4_bus_transceivers (U2.3)
HA18_N: FMC_HPC_400 (P1.J19), WAB_1x4_HSMC_slots (J0.79)
HA18_P: FMC_HPC_400 (P1.J18), WAB_1x4_HSMC_slots (J0.71)
HA19_N: FMC_HPC_400 (P1.F20), WAB_1x4_bus_transceivers (U4.7)
HA19_P: FMC_HPC_400 (P1.F19), WAB_1x4_bus_transceivers (U4.6)
HA20_N: FMC_HPC_400 (P1.E19), WAB_1x4_bus_transceivers (U5.9)
HA20_P: FMC_HPC_400 (P1.E18), WAB_1x4_bus_transceivers (U1.4)
HA21_N: FMC_HPC_400 (P1.K20), WAB_1x4_bus_transceivers (U1.3)
HA21_P: FMC_HPC_400 (P1.K19), WAB_1x4_bus_transceivers (U5.8)
HA22_N: FMC_HPC_400 (P1.J22), WAB_1x4_bus_transceivers (U4.8)
HA22_P: FMC_HPC_400 (P1.J21), WAB_1x4_bus_transceivers (U7.7)
HA23_N: FMC_HPC_400 (P1.K23), WAB_1x4_bus_transceivers (U1.7)
HA23_P: FMC_HPC_400 (P1.K22), WAB_1x4_bus_transceivers (U7.8)
HB00_CC_N: FMC_HPC_400 (P1.K26), WAB_1x4_bus_transceivers (U6.10)
HB00_CC_P: FMC_HPC_400 (P1.K25), WAB_1x4_HSMC_slots (J1.120)
HB01_N: FMC_HPC_400 (P1.J25), WAB_1x4_HSMC_slots (J1.56)
HB01_P: FMC_HPC_400 (P1.J24), WAB_1x4_HSMC_slots (J1.54)
HB02_N: FMC_HPC_400 (P1.F23), WAB_1x4_HSMC_slots (J1.50)
HB02_P: FMC_HPC_400 (P1.F22), WAB_1x4_HSMC_slots (J1.48)
HB03_N: FMC_HPC_400 (P1.E22), WAB_1x4_HSMC_slots (J1.44)
HB03_P: FMC_HPC_400 (P1.E21), WAB_1x4_HSMC_slots (J1.42)
HB04_N: FMC_HPC_400 (P1.F26), WAB_1x4_HSMC_slots (J1.62)
HB04_P: FMC_HPC_400 (P1.F25), WAB_1x4_HSMC_slots (J1.60)
HB05_N: FMC_HPC_400 (P1.E25), WAB_1x4_bus_transceivers (U6.9)
HB05_P: FMC_HPC_400 (P1.E24), WAB_1x4_bus_transceivers (U1.6)
HB06_CC_N: FMC_HPC_400 (P1.K29), WAB_1x4_bus_transceivers (U3.5)
HB06_CC_P: FMC_HPC_400 (P1.K28), WAB_1x4_HSMC_slots (J1.96)
HB07_N: FMC_HPC_400 (P1.J28), WAB_1x4_HSMC_slots (J1.72)
HB07_P: FMC_HPC_400 (P1.J27), WAB_1x4_HSMC_slots (J1.66)
HB08_N: FMC_HPC_400 (P1.F29), WAB_1x4_HSMC_slots (J1.41)
HB08_P: FMC_HPC_400 (P1.F28), WAB_1x4_HSMC_slots (J1.80)
HB09_N: FMC_HPC_400 (P1.E28), WAB_1x4_HSMC_slots (J1.74)
HB09_P: FMC_HPC_400 (P1.E27), WAB_1x4_HSMC_slots (J1.68)
HB10_N: FMC_HPC_400 (P1.K32), WAB_1x4_HSMC_slots (J1.65)
HB10_P: FMC_HPC_400 (P1.K31), WAB_1x4_HSMC_slots (J1.59)
HB11_N: FMC_HPC_400 (P1.J31), WAB_1x4_HSMC_slots (J1.55)
HB11_P: FMC_HPC_400 (P1.J30), WAB_1x4_HSMC_slots (J1.43)
HB12_N: FMC_HPC_400 (P1.F32), WAB_1x4_HSMC_slots (J1.61)
HB12_P: FMC_HPC_400 (P1.F31), WAB_1x4_HSMC_slots (J1.49)
HB13_N: FMC_HPC_400 (P1.E31), WAB_1x4_HSMC_slots (J1.53)
HB13_P: FMC_HPC_400 (P1.E30), WAB_1x4_HSMC_slots (J1.47)
HB14_N: FMC_HPC_400 (P1.K35), WAB_1x4_HSMC_slots (J1.79)
HB14_P: FMC_HPC_400 (P1.K34), WAB_1x4_HSMC_slots (J1.73)
HB15_N: FMC_HPC_400 (P1.J34), WAB_1x4_HSMC_slots (J1.71)
HB15_P: FMC_HPC_400 (P1.J33), WAB_1x4_HSMC_slots (J1.67)
HB16_N: FMC_HPC_400 (P1.F35), WAB_1x4_bus_transceivers (U3.7)
HB16_P: FMC_HPC_400 (P1.F34), WAB_1x4_bus_transceivers (U3.6)
HB17_CC_N: FMC_HPC_400 (P1.K38), WAB_1x4_bus_transceivers (U3.4)
HB17_CC_P: FMC_HPC_400 (P1.K37), WAB_1x4_bus_transceivers (U3.3)
HB18_N: FMC_HPC_400 (P1.J37), WAB_1x4_bus_transceivers (U3.8)
HB18_P: FMC_HPC_400 (P1.J36), WAB_1x4_bus_transceivers (U6.7)
HB19_N: FMC_HPC_400 (P1.E34), WAB_1x4_bus_transceivers (U1.5)
HB19_P: FMC_HPC_400 (P1.E33), WAB_1x4_bus_transceivers (U6.8)
LA00_CC_N: FMC_HPC_400 (P1.G7), WAB_1x4_bus_transceivers (U7.10)
LA00_CC_P: FMC_HPC_400 (P1.G6), WAB_1x4_HSMC_slots (J2.120)
LA01_CC_N: FMC_HPC_400 (P1.D9), WAB_1x4_bus_transceivers (U4.5)
LA01_CC_P: FMC_HPC_400 (P1.D8), WAB_1x4_HSMC_slots (J2.96)
LA02_N: FMC_HPC_400 (P1.H8), WAB_1x4_HSMC_slots (J2.48)
LA02_P: FMC_HPC_400 (P1.H7), WAB_1x4_HSMC_slots (J2.44)
LA03_N: FMC_HPC_400 (P1.G10), WAB_1x4_HSMC_slots (J2.60)
LA03_P: FMC_HPC_400 (P1.G9), WAB_1x4_HSMC_slots (J2.50)
LA04_N: FMC_HPC_400 (P1.H11), WAB_1x4_HSMC_slots (J2.62)
LA04_P: FMC_HPC_400 (P1.H10), WAB_1x4_HSMC_slots (J2.54)
LA05_N: FMC_HPC_400 (P1.D12), WAB_1x4_HSMC_slots (J2.72)
LA05_P: FMC_HPC_400 (P1.D11), WAB_1x4_HSMC_slots (J2.68)
LA06_N: FMC_HPC_400 (P1.C11), WAB_1x4_HSMC_slots (J2.66)
LA06_P: FMC_HPC_400 (P1.C10), WAB_1x4_HSMC_slots (J2.56)
LA07_N: FMC_HPC_400 (P1.H14), WAB_1x4_bus_transceivers (U4.4)
LA07_P: FMC_HPC_400 (P1.H13), WAB_1x4_bus_transceivers (U4.3)
LA08_N: FMC_HPC_400 (P1.G13), WAB_1x4_HSMC_slots (J2.41)
LA08_P: FMC_HPC_400 (P1.G12), WAB_1x4_HSMC_slots (J2.74)
LA09_N: FMC_HPC_400 (P1.D15), WAB_1x4_bus_transceivers (U7.9)
LA09_P: FMC_HPC_400 (P1.D14), WAB_1x4_bus_transceivers (U1.8)
LA10_N: FMC_HPC_400 (P1.C15), WAB_1x4_HSMC_slots (J2.49)
LA10_P: FMC_HPC_400 (P1.C14), WAB_1x4_HSMC_slots (J2.43)
LA11_N: FMC_HPC_400 (P1.H17), WAB_1x4_HSMC_slots (J2.73)
LA11_P: FMC_HPC_400 (P1.H16), WAB_1x4_HSMC_slots (J2.71)
LA12_N: FMC_HPC_400 (P1.G16), WAB_1x4_HSMC_slots (J2.59)
LA12_P: FMC_HPC_400 (P1.G15), WAB_1x4_HSMC_slots (J2.53)
LA13_N: FMC_HPC_400 (P1.D18), WAB_1x4_HSMC_slots (J2.67)
LA13_P: FMC_HPC_400 (P1.D17), WAB_1x4_HSMC_slots (J2.61)
LA14_N: FMC_HPC_400 (P1.C19), WAB_1x4_bus_transceivers (U8.9)
LA14_P: FMC_HPC_400 (P1.C18), WAB_1x4_bus_transceivers (U1.10)
LA15_N: FMC_HPC_400 (P1.H20), WAB_1x4_HSMC_slots (J3.49)
LA15_P: FMC_HPC_400 (P1.H19), WAB_1x4_HSMC_slots (J3.47)
LA16_N: FMC_HPC_400 (P1.G19), WAB_1x4_HSMC_slots (J3.43)
LA16_P: FMC_HPC_400 (P1.G18), WAB_1x4_HSMC_slots (J3.41)
LA17_CC_N: FMC_HPC_400 (P1.D21), WAB_1x4_bus_transceivers (U8.10)
LA17_CC_P: FMC_HPC_400 (P1.D20), WAB_1x4_HSMC_slots (J3.120)
LA18_CC_N: FMC_HPC_400 (P1.C23), WAB_1x4_bus_transceivers (U3.9)
LA18_CC_P: FMC_HPC_400 (P1.C22), WAB_1x4_HSMC_slots (J3.96)
LA19_N: FMC_HPC_400 (P1.H23), WAB_1x4_HSMC_slots (J3.65)
LA19_P: FMC_HPC_400 (P1.H22), WAB_1x4_HSMC_slots (J3.59)
LA20_N: FMC_HPC_400 (P1.G22), WAB_1x4_HSMC_slots (J3.55)
LA20_P: FMC_HPC_400 (P1.G21), WAB_1x4_HSMC_slots (J3.53)
LA21_N: FMC_HPC_400 (P1.H26), WAB_1x4_HSMC_slots (J3.42)
LA21_P: FMC_HPC_400 (P1.H25), WAB_1x4_HSMC_slots (J3.79)
LA22_N: FMC_HPC_400 (P1.G25), WAB_1x4_HSMC_slots (J3.73)
LA22_P: FMC_HPC_400 (P1.G24), WAB_1x4_HSMC_slots (J3.71)
LA23_N: FMC_HPC_400 (P1.D24), WAB_1x4_HSMC_slots (J3.67)
LA23_P: FMC_HPC_400 (P1.D23), WAB_1x4_HSMC_slots (J3.61)
LA24_N: FMC_HPC_400 (P1.H29), WAB_1x4_HSMC_slots (J3.62)
LA24_P: FMC_HPC_400 (P1.H28), WAB_1x4_HSMC_slots (J3.54)
LA25_N: FMC_HPC_400 (P1.G28), WAB_1x4_HSMC_slots (J3.56)
LA25_P: FMC_HPC_400 (P1.G27), WAB_1x4_HSMC_slots (J3.48)
LA26_N: FMC_HPC_400 (P1.D27), WAB_1x4_HSMC_slots (J3.50)
LA26_P: FMC_HPC_400 (P1.D26), WAB_1x4_HSMC_slots (J3.44)
LA27_N: FMC_HPC_400 (P1.C27), WAB_1x4_bus_transceivers (U2.10)
LA27_P: FMC_HPC_400 (P1.C26), WAB_1x4_bus_transceivers (U2.9)
LA28_N: FMC_HPC_400 (P1.H32), WAB_1x4_HSMC_slots (J3.74)
LA28_P: FMC_HPC_400 (P1.H31), WAB_1x4_HSMC_slots (J3.66)
LA29_N: FMC_HPC_400 (P1.G31), WAB_1x4_HSMC_slots (J3.68)
LA29_P: FMC_HPC_400 (P1.G30), WAB_1x4_HSMC_slots (J3.60)
LA30_N: FMC_HPC_400 (P1.H35), WAB_1x4_HSMC_slots (J3.80)
LA30_P: FMC_HPC_400 (P1.H34), WAB_1x4_HSMC_slots (J3.72)
LA31_N: FMC_HPC_400 (P1.G34), WAB_1x4_bus_transceivers (U4.9)
LA31_P: FMC_HPC_400 (P1.G33), WAB_1x4_bus_transceivers (U3.10)
LA32_N: FMC_HPC_400 (P1.H38), WAB_1x4_bus_transceivers (U4.10)
LA32_P: FMC_HPC_400 (P1.H37), WAB_1x4_bus_transceivers (U8.7)
LA33_N: FMC_HPC_400 (P1.G37), WAB_1x4_bus_transceivers (U8.8)
LA33_P: FMC_HPC_400 (P1.G36), WAB_1x4_bus_transceivers (U1.9)
NetSW1_5: WAB_1x4_bus_transceivers (8 pins), WAB_1x4_top (SW1.5)
Q0_LED_1: WAB_1x4_bus_transceivers (U5.21), WAB_1x4_HSMC_slots (J0.26)
Q0_LED_2: WAB_1x4_bus_transceivers (U5.20), WAB_1x4_HSMC_slots (J0.28)
Q0_LED_3: WAB_1x4_bus_transceivers (U5.19), WAB_1x4_HSMC_slots (J0.30)
Q0_LED_4: WAB_1x4_bus_transceivers (U5.18), WAB_1x4_HSMC_slots (J0.32)
Q0_PLLCLK: WAB_1x4_HSMC_slots (J0.39), WAB_1x4_top (C42.2)
Q0_RX_CLK: WAB_1x4_HSMC_slots (J0.95 R1.1), WAB_1x4_top (U11.3)
Q0_RX_EN: WAB_1x4_bus_transceivers (U2.17), WAB_1x4_HSMC_slots (J0.77)
Q0_SPI_CLK: WAB_1x4_bus_transceivers (U2.21), WAB_1x4_HSMC_slots (J0.90)
Q0_SPI_FSS: WAB_1x4_bus_transceivers (U2.19), WAB_1x4_HSMC_slots (J0.84)
Q0_SPI_RX: WAB_1x4_bus_transceivers (U1.20), WAB_1x4_HSMC_slots (J0.86)
Q0_SPI_SEL: WAB_1x4_bus_transceivers (U5.14), WAB_1x4_HSMC_slots (J0.92)
Q0_SPI_TX: WAB_1x4_bus_transceivers (U2.20), WAB_1x4_HSMC_slots (J0.85)
Q0_TRX_RESET: WAB_1x4_bus_transceivers (U2.16), WAB_1x4_HSMC_slots (J0.83)
Q0_TX_EN: WAB_1x4_bus_transceivers (U2.18), WAB_1x4_HSMC_slots (J0.78)
Q0_UART_RX: WAB_1x4_bus_transceivers (U5.17), WAB_1x4_HSMC_slots (J0.91)
Q0_UART_TX: WAB_1x4_bus_transceivers (U1.21), WAB_1x4_HSMC_slots (J0.89)
Q0_UC_NMI: WAB_1x4_bus_transceivers (U5.15), WAB_1x4_HSMC_slots (J0.119)
Q0_UC_SW_TX: WAB_1x4_bus_transceivers (U5.16), WAB_1x4_HSMC_slots (J0.115)
Q1_LED_1: WAB_1x4_bus_transceivers (U6.21), WAB_1x4_HSMC_slots (J1.26)
Q1_LED_2: WAB_1x4_bus_transceivers (U6.20), WAB_1x4_HSMC_slots (J1.28)
Q1_LED_3: WAB_1x4_bus_transceivers (U6.19), WAB_1x4_HSMC_slots (J1.30)
Q1_LED_4: WAB_1x4_bus_transceivers (U6.18), WAB_1x4_HSMC_slots (J1.32)
Q1_PLLCLK: WAB_1x4_HSMC_slots (J1.39), WAB_1x4_top (C43.2)
Q1_RX_CLK: WAB_1x4_HSMC_slots (J1.95 R2.1), WAB_1x4_top (U11.5)
Q1_RX_EN: WAB_1x4_bus_transceivers (U3.17), WAB_1x4_HSMC_slots (J1.77)
Q1_SPI_CLK: WAB_1x4_bus_transceivers (U3.21), WAB_1x4_HSMC_slots (J1.90)
Q1_SPI_FSS: WAB_1x4_bus_transceivers (U3.19), WAB_1x4_HSMC_slots (J1.84)
Q1_SPI_RX: WAB_1x4_bus_transceivers (U1.18), WAB_1x4_HSMC_slots (J1.86)
Q1_SPI_SEL: WAB_1x4_bus_transceivers (U6.14), WAB_1x4_HSMC_slots (J1.92)
Q1_SPI_TX: WAB_1x4_bus_transceivers (U3.20), WAB_1x4_HSMC_slots (J1.85)
Q1_TRX_RESET: WAB_1x4_bus_transceivers (U3.16), WAB_1x4_HSMC_slots (J1.83)
Q1_TX_EN: WAB_1x4_bus_transceivers (U3.18), WAB_1x4_HSMC_slots (J1.78)
Q1_UART_RX: WAB_1x4_bus_transceivers (U6.17), WAB_1x4_HSMC_slots (J1.91)
Q1_UART_TX: WAB_1x4_bus_transceivers (U1.19), WAB_1x4_HSMC_slots (J1.89)
Q1_UC_NMI: WAB_1x4_bus_transceivers (U6.15), WAB_1x4_HSMC_slots (J1.119)
Q1_UC_SW_TX: WAB_1x4_bus_transceivers (U6.16), WAB_1x4_HSMC_slots (J1.115)
Q2_LED_1: WAB_1x4_bus_transceivers (U7.21), WAB_1x4_HSMC_slots (J2.26)
Q2_LED_2: WAB_1x4_bus_transceivers (U7.20), WAB_1x4_HSMC_slots (J2.28)
Q2_LED_3: WAB_1x4_bus_transceivers (U7.19), WAB_1x4_HSMC_slots (J2.30)
Q2_LED_4: WAB_1x4_bus_transceivers (U7.18), WAB_1x4_HSMC_slots (J2.32)
Q2_PLLCLK: WAB_1x4_HSMC_slots (J2.39), WAB_1x4_top (C44.2)
Q2_RX_CLK: WAB_1x4_HSMC_slots (J2.95 R3.1), WAB_1x4_top (U11.13)
Q2_RX_EN: WAB_1x4_bus_transceivers (U4.17), WAB_1x4_HSMC_slots (J2.77)
Q2_SPI_CLK: WAB_1x4_bus_transceivers (U4.21), WAB_1x4_HSMC_slots (J2.90)
Q2_SPI_FSS: WAB_1x4_bus_transceivers (U4.19), WAB_1x4_HSMC_slots (J2.84)
Q2_SPI_RX: WAB_1x4_bus_transceivers (U1.16), WAB_1x4_HSMC_slots (J2.86)
Q2_SPI_SEL: WAB_1x4_bus_transceivers (U7.14), WAB_1x4_HSMC_slots (J2.92)
Q2_SPI_TX: WAB_1x4_bus_transceivers (U4.20), WAB_1x4_HSMC_slots (J2.85)
Q2_TRX_RESET: WAB_1x4_bus_transceivers (U4.16), WAB_1x4_HSMC_slots (J2.83)
Q2_TX_EN: WAB_1x4_bus_transceivers (U4.18), WAB_1x4_HSMC_slots (J2.78)
Q2_UART_RX: WAB_1x4_bus_transceivers (U7.17), WAB_1x4_HSMC_slots (J2.91)
Q2_UART_TX: WAB_1x4_bus_transceivers (U1.17), WAB_1x4_HSMC_slots (J2.89)
Q2_UC_NMI: WAB_1x4_bus_transceivers (U7.15), WAB_1x4_HSMC_slots (J2.119)
Q2_UC_SW_TX: WAB_1x4_bus_transceivers (U7.16), WAB_1x4_HSMC_slots (J2.115)
Q3_LED_1: WAB_1x4_bus_transceivers (U8.21), WAB_1x4_HSMC_slots (J3.26)
Q3_LED_2: WAB_1x4_bus_transceivers (U8.20), WAB_1x4_HSMC_slots (J3.28)
Q3_LED_3: WAB_1x4_bus_transceivers (U8.19), WAB_1x4_HSMC_slots (J3.30)
Q3_LED_4: WAB_1x4_bus_transceivers (U8.18), WAB_1x4_HSMC_slots (J3.32)
Q3_PLLCLK: WAB_1x4_HSMC_slots (J3.39), WAB_1x4_top (C45.2)
Q3_RX_CLK: WAB_1x4_HSMC_slots (J3.95 R4.1), WAB_1x4_top (U11.15)
Q3_RX_EN: WAB_1x4_bus_transceivers (U4.15), WAB_1x4_HSMC_slots (J3.77)
Q3_SPI_CLK: WAB_1x4_bus_transceivers (U2.15), WAB_1x4_HSMC_slots (J3.90)
Q3_SPI_FSS: WAB_1x4_bus_transceivers (U3.15), WAB_1x4_HSMC_slots (J3.84)
Q3_SPI_RX: WAB_1x4_bus_transceivers (U1.14), WAB_1x4_HSMC_slots (J3.86)
Q3_SPI_SEL: WAB_1x4_bus_transceivers (U8.14), WAB_1x4_HSMC_slots (J3.92)
Q3_SPI_TX: WAB_1x4_bus_transceivers (U2.14), WAB_1x4_HSMC_slots (J3.85)
Q3_TRX_RESET: WAB_1x4_bus_transceivers (U4.14), WAB_1x4_HSMC_slots (J3.83)
Q3_TX_EN: WAB_1x4_bus_transceivers (U3.14), WAB_1x4_HSMC_slots (J3.78)
Q3_UART_RX: WAB_1x4_bus_transceivers (U8.17), WAB_1x4_HSMC_slots (J3.91)
Q3_UART_TX: WAB_1x4_bus_transceivers (U1.15), WAB_1x4_HSMC_slots (J3.89)
Q3_UC_NMI: WAB_1x4_bus_transceivers (U8.15), WAB_1x4_HSMC_slots (J3.119)
Q3_UC_SW_TX: WAB_1x4_bus_transceivers (U8.16), WAB_1x4_HSMC_slots (J3.115)